# Altium schematic sheet battery_charger_li-ion.SchDoc: Battery charger
size A4; SheetNumber: 10; SheetTotal: 20; TitleBig: Battery charging circuitry for Li-Po & Li-Ion; Desc_line1: Battery charger circuit variant #2. Li-Ion and Li-Po batteries offer much more power density at the cost of inestability.; Desc_line2: This circuit must NOT be placed if the Ni-MH charger is present on the board (and vice-versa).
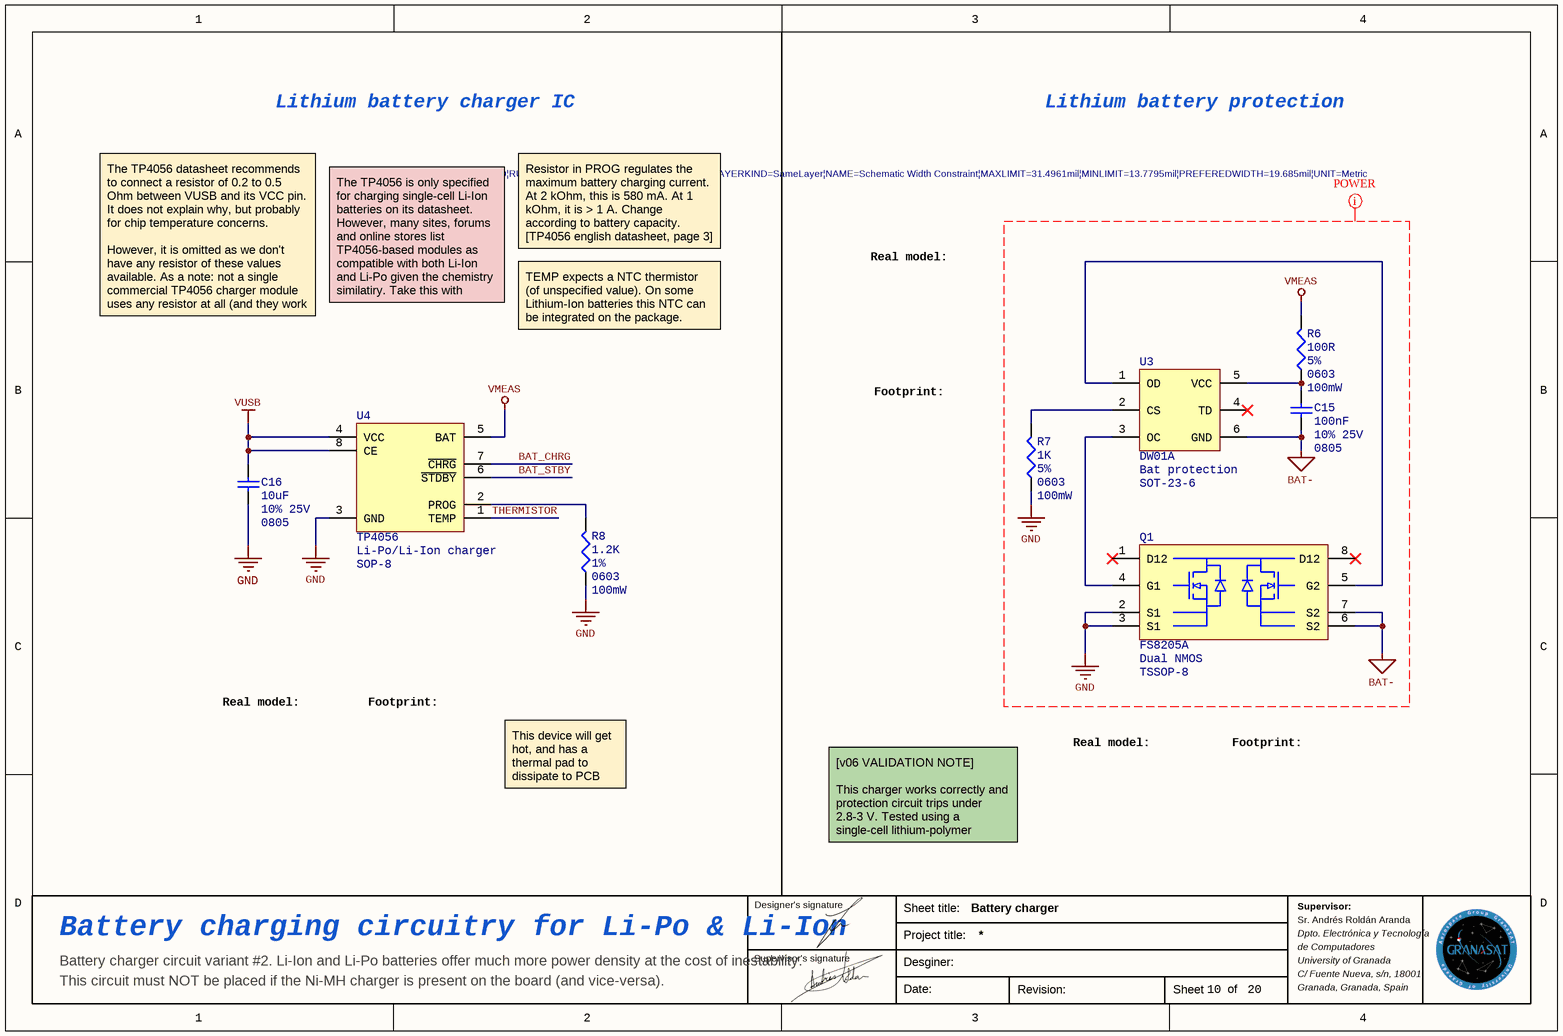
[diagram p0: battery_charger_li-ion.SchDoc]

## Parts
C15  value 100nF  Tolerance: 10% 25V  PackageDescription: 0805  [CAP 0805_2012]  (hidden comment: Cap_cer_0805)
C16  value 10uF  Tolerance: 10% 25V  PackageDescription: 0805  [CAP 0805_2012]  (hidden comment: Cap_cer_0805)
Q1  Type: Dual NMOS  PackageDescription: TSSOP-8  [TSSOP-8 FS8205A]  (hidden comment: FS8205A)
R6  value 100R  Tolerance: 5%  PackageDescription: 0603  PowerDisipated: 100mW  [RES 0603_1608]  (hidden comment: Res_0603_100R_5%_100mW)
R7  value 1K  Tolerance: 5%  PackageDescription: 0603  PowerDisipated: 100mW  [RES 0603_1608]  (hidden comment: Res_0603_1K_5%_100mW)
R8  value 1.2K  Tolerance: 1%  PackageDescription: 0603  PowerDisipated: 100mW  [RES 0603_1608]  (hidden comment: Res_0603_1.2K_1%_100mW)
U3  Type: Bat protection  PackageDescription: SOT-23-6  [SOT-23-6 DW01A]  (hidden comment: DW01A)
U4  Type: Li-Po/Li-Ion charger  PackageDescription: SOP-8  [SOIC-8-D0008A TP4056]  (hidden comment: TP4056)

## Nets
BAT-: C15.1 Q1.6(S2) Q1.7(S2) U3.6(GND)
GND: C16.1 Q1.2(S1) Q1.3(S1) R7.1 R8.1 U4.3(GND)
VMEAS: R6.2 U4.5(BAT)
VUSB: C16.2 U4.4(VCC) U4.8(CE)
BAT_CHRG: U4.7(~{CHRG})
BAT_STBY: U4.6(~{STDBY})
THERMISTOR: U4.1(TEMP)
NetC15_2: C15.2 R6.1 U3.5(VCC)
NetQ1_4: Q1.4(G1) U3.3(OC)
NetQ1_5: Q1.5(G2) U3.1(OD)
NetR7_2: R7.2 U3.2(CS)
NetR8_2: R8.2 U4.2(PROG)

Not connected (* = marked no-connect by the designer): Q1 1(D12)* 8(D12)*; U3 4(TD)*

## Layout directives
net class POWER; rule Width Constraint [Pref Width = 0.5mm    Min Width = 0.35mm    Max Width = 0.8mm]: BAT-, GND, VMEAS

## Notes on the sheet
- Lithium battery charger IC
- Lithium battery protection
- Resistor in PROG regulates the maximum battery charging current. At 2 kOhm, this is 580 mA. At 1 kOhm, it is > 1 A. Change according to battery capacity. [TP4056 english datasheet, page 3]
- The TP4056 datasheet recommends to connect a resistor of 0.2 to 0.5 Ohm between VUSB and its VCC pin. It does not explain why, but probably for chip temperature concerns.
  However, it is omitted as we don't have any resistor of these values available. As a note: not a single commercial TP4056 charger module uses any resistor at all (and they work fine at higher charge rates).
- The TP4056 is only specified for charging single-cell Li-Ion batteries on its datasheet. However, many sites, forums and online stores list TP4056-based modules as compatible with both Li-Ion and Li-Po given the chemistry similatiry. Take this with caution.
- Real model:
- TEMP expects a NTC thermistor (of unspecified value). On some Lithium-Ion batteries this NTC can be integrated on the package.
- Footprint:
- This device will get hot, and has a thermal pad to dissipate to PCB GND plane
- [v06 VALIDATION NOTE]
  This charger works correctly and protection circuit trips under 2.8-3 V. Tested using a single-cell lithium-polymer battery.
- Designer's signature
- Sheet title:
- Sr. Andrés Roldán Aranda
- Supervisor:
- Supervisor's signature
- Project title:
- Desginer:
- Dpto. Electrónica y Tecnología
- de Computadores
- University of Granada
- C/ Fuente Nueva, s/n, 18001
- Granada, Granada, Spain
- Date:
- Revision:
- Sheet
- of

## Library data of the parts
C15 = Cap_cer_0805_100nF_10%: Ceramic cap size 0805; FabGroup: Charger for Li-Ion; FabOrder: 4
C16 = Cap_cer_0805_10uF_10%: Ceramic cap size 0805; FabGroup: Charger for Li-Ion; FabOrder: 4
Q1 = IC FS8205A Dual NMOS: Dual N-channel Enhancement mode power MOSFET; ComponentLink1Description: New link; ComponentLink1URL: *; Part: FS8205A
R6 = Res_0603_100R_5%_100mW: Res size 0603 SMD mounting, low power
R7 = Res_0603_1K_5%_100mW: Res size 0603 SMD mounting, low power
R8 = Res_0603_1.2K_1%_100mW: Res size 0603 SMD mounting, low power
U3 = IC DW01A bat protection: DW01A One cell Li-Po/Li-ion Battery protection IC; FabGroup: Charger for Li-Ion; FabOrder: 4; Part: DW01A
U4 = IC TP4056 BAT Charger: 1A Standalone Linear Li-lon Battery Charger with Thermal Regulation in SOP-8; Part: TP4056